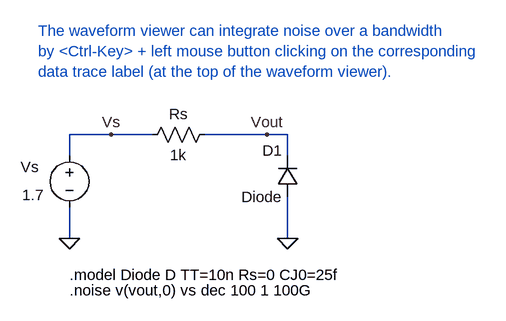
[diagram p0: schematic Ex8_13.asc]
Ex8_13.asc, the LTspice schematic file:
Version 4
SHEET 1 1072 704
WIRE 240 224 240 192
WIRE 240 352 240 304
WIRE 304 192 240 192
WIRE 368 192 304 192
WIRE 544 192 448 192
WIRE 576 192 544 192
WIRE 576 224 576 192
WIRE 576 352 576 288
FLAG 240 352 0
FLAG 576 352 0
FLAG 544 192 Vout
FLAG 304 192 Vs
SYMBOL voltage 240 208 R0
WINDOW 0 -75 34 Left 0
WINDOW 3 -73 77 Left 0
WINDOW 123 0 0 Left 0
WINDOW 39 0 0 Left 0
SYMATTR InstName Vs
SYMATTR Value 1.7
SYMBOL res 352 208 R270
WINDOW 0 32 56 VTop 0
WINDOW 3 0 56 VBottom 0
SYMATTR InstName Rs
SYMATTR Value 1k
SYMBOL diode 592 288 R180
WINDOW 0 24 72 Left 0
WINDOW 3 24 0 Left 0
SYMATTR InstName D1
SYMATTR Value Diode
TEXT 240 432 Left 0 !.noise v(vout,0) vs dec 100 1 100G
TEXT 192 32 Left 0 ;The waveform viewer can integrate noise over a bandwidth \nby <Ctrl-Key> + left mouse button clicking on the corresponding \ndata trace label (at the top of the waveform viewer).
TEXT 240 408 Left 0 !.model Diode D TT=10n Rs=0 CJ0=25f

The netlist it stands for:
* Ex8_13.asc
Vs Vs 0 1.7
Rs Vs Vout 1k
D1 0 Vout Diode
.model D D
.lib standard.dio
.noise v(vout,0) vs dec 100 1 100G
* The waveform viewer can integrate noise over a bandwidth
* by <Ctrl-Key> + left mouse button clicking on the corresponding
* data trace label (at the top of the waveform viewer).
.model Diode D TT=10n Rs=0 CJ0=25f
.backanno
.end